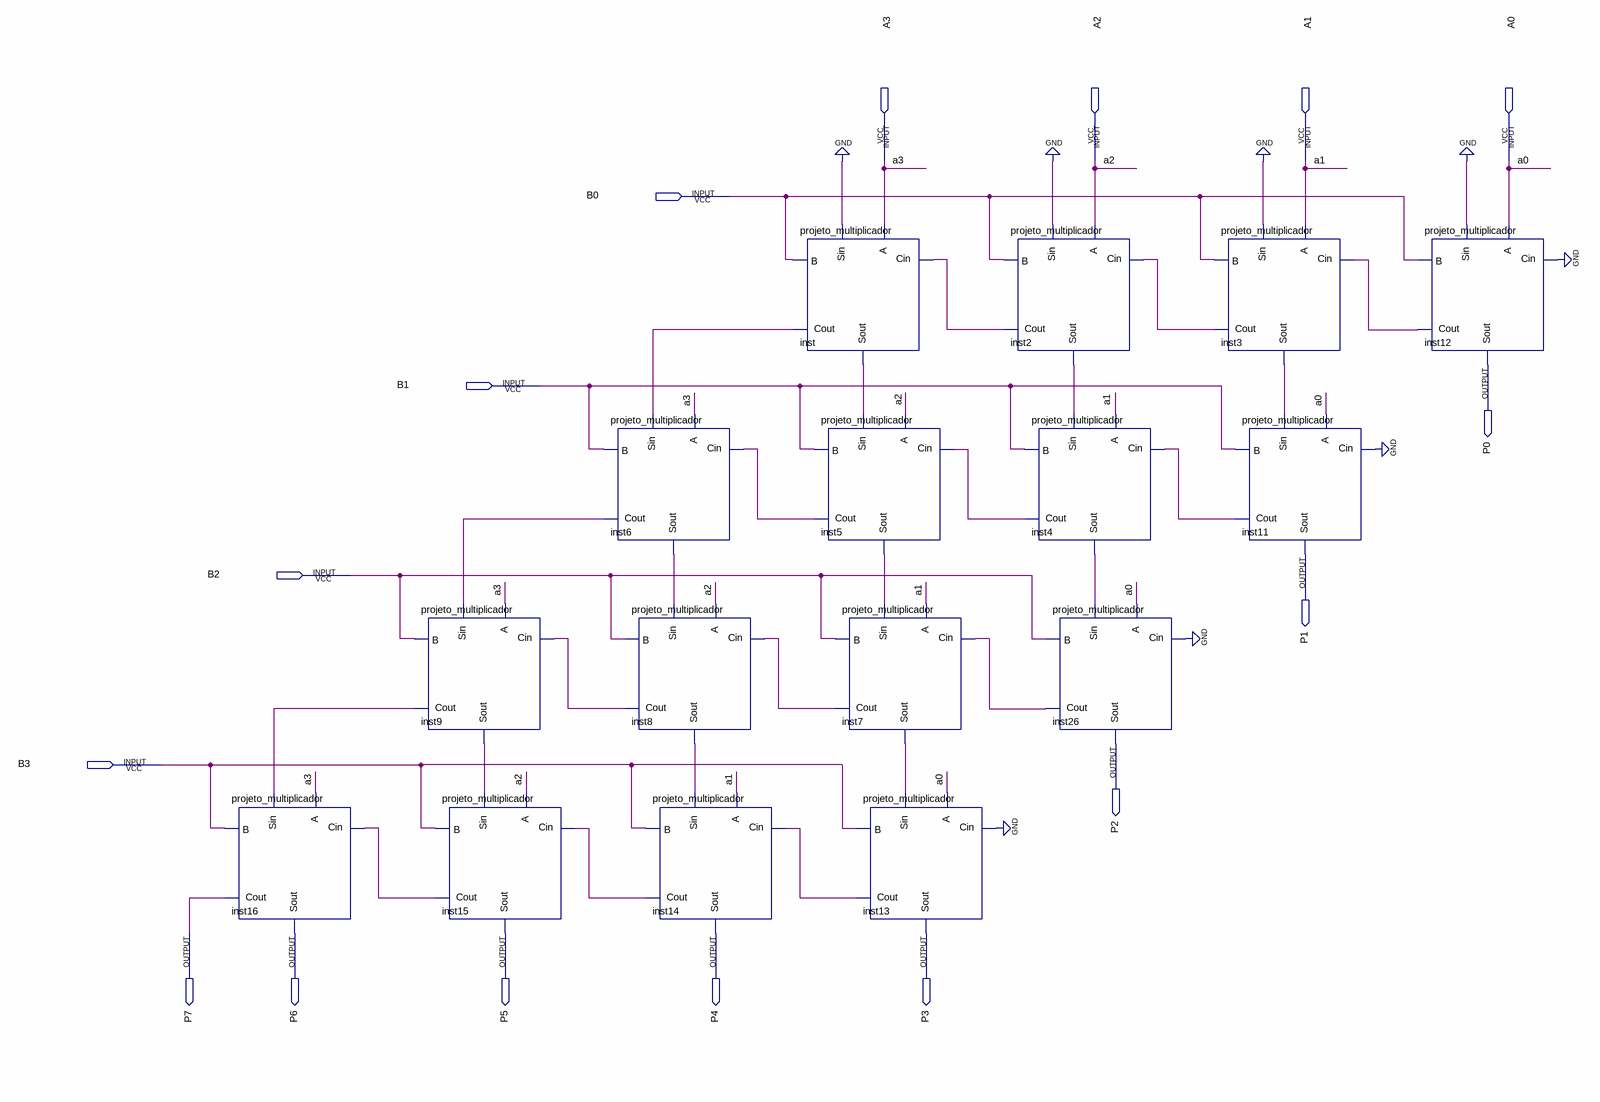
[diagram p0: schematic sheet]
// Quartus schematic multiplicador_4bit.bdf as structural Verilog: 16 symbols, 16 pins
module multiplicador_4bit (
  input  A3,
  input  A2,
  input  A1,
  input  A0,
  input  B0,
  input  B1,
  input  B2,
  input  B3,
  output P0,
  output P1,
  output P2,
  output P7,
  output P6,
  output P5,
  output P4,
  output P3
);

  wire inst2_cout, inst2_sout, inst3_cout, inst3_sout, inst4_cout, inst4_sout, inst5_cout, inst5_sout,
       inst6_cout, inst6_sout, inst7_cout, inst7_sout, inst8_cout, inst8_sout, inst9_cout, inst9_sout,
       inst11_cout, inst12_cout, inst13_cout, inst14_cout, inst15_cout, inst26_cout, inst_cout, inst_sout;

  projeto_multiplicador inst16 (.Sin(inst9_cout), .A(A3), .B(B3), .Cin(inst15_cout), .Sout(P6), .Cout(P7));
  projeto_multiplicador inst9 (
    .Sin(inst6_cout), .A(A3), .B(B2), .Cin(inst8_cout), .Sout(inst9_sout), .Cout(inst9_cout));
  projeto_multiplicador inst15 (.Sin(inst9_sout), .A(A2), .B(B3), .Cin(inst14_cout), .Sout(P5), .Cout(inst15_cout));
  projeto_multiplicador inst6 (.Sin(inst_cout), .A(A3), .B(B1), .Cin(inst5_cout), .Sout(inst6_sout), .Cout(inst6_cout));
  projeto_multiplicador inst8 (
    .Sin(inst6_sout), .A(A2), .B(B2), .Cin(inst7_cout), .Sout(inst8_sout), .Cout(inst8_cout));
  projeto_multiplicador inst14 (.Sin(inst8_sout), .A(A1), .B(B3), .Cin(inst13_cout), .Sout(P4), .Cout(inst14_cout));
  projeto_multiplicador inst (.Sin(1'b0), .A(A3), .B(B0), .Cin(inst2_cout), .Sout(inst_sout), .Cout(inst_cout));
  projeto_multiplicador inst5 (.Sin(inst_sout), .A(A2), .B(B1), .Cin(inst4_cout), .Sout(inst5_sout), .Cout(inst5_cout));
  projeto_multiplicador inst7 (
    .Sin(inst5_sout), .A(A1), .B(B2), .Cin(inst26_cout), .Sout(inst7_sout), .Cout(inst7_cout));
  projeto_multiplicador inst13 (.Sin(inst7_sout), .A(A0), .B(B3), .Cin(1'b0), .Sout(P3), .Cout(inst13_cout));
  projeto_multiplicador inst2 (.Sin(1'b0), .A(A2), .B(B0), .Cin(inst3_cout), .Sout(inst2_sout), .Cout(inst2_cout));
  projeto_multiplicador inst4 (
    .Sin(inst2_sout), .A(A1), .B(B1), .Cin(inst11_cout), .Sout(inst4_sout), .Cout(inst4_cout));
  projeto_multiplicador inst26 (.Sin(inst4_sout), .A(A0), .B(B2), .Cin(1'b0), .Sout(P2), .Cout(inst26_cout));
  projeto_multiplicador inst3 (.Sin(1'b0), .A(A1), .B(B0), .Cin(inst12_cout), .Sout(inst3_sout), .Cout(inst3_cout));
  projeto_multiplicador inst11 (.Sin(inst3_sout), .A(A0), .B(B1), .Cin(1'b0), .Sout(P1), .Cout(inst11_cout));
  projeto_multiplicador inst12 (.Sin(1'b0), .A(A0), .B(B0), .Cin(1'b0), .Sout(P0), .Cout(inst12_cout));
endmodule
